# EasyEDA Pro project Automatic-Watering.eprj

# Schematic Schematic1
Board Name: Board1; Create Date: 2024-10-25; Page Name: P1; Project Name: 办公室盆栽自动浇水仪; Schematic Name: Schematic1; Update Date: 2024-12-15; Company: 嘉立创EDA; Page Size: A4; Version: V1.0
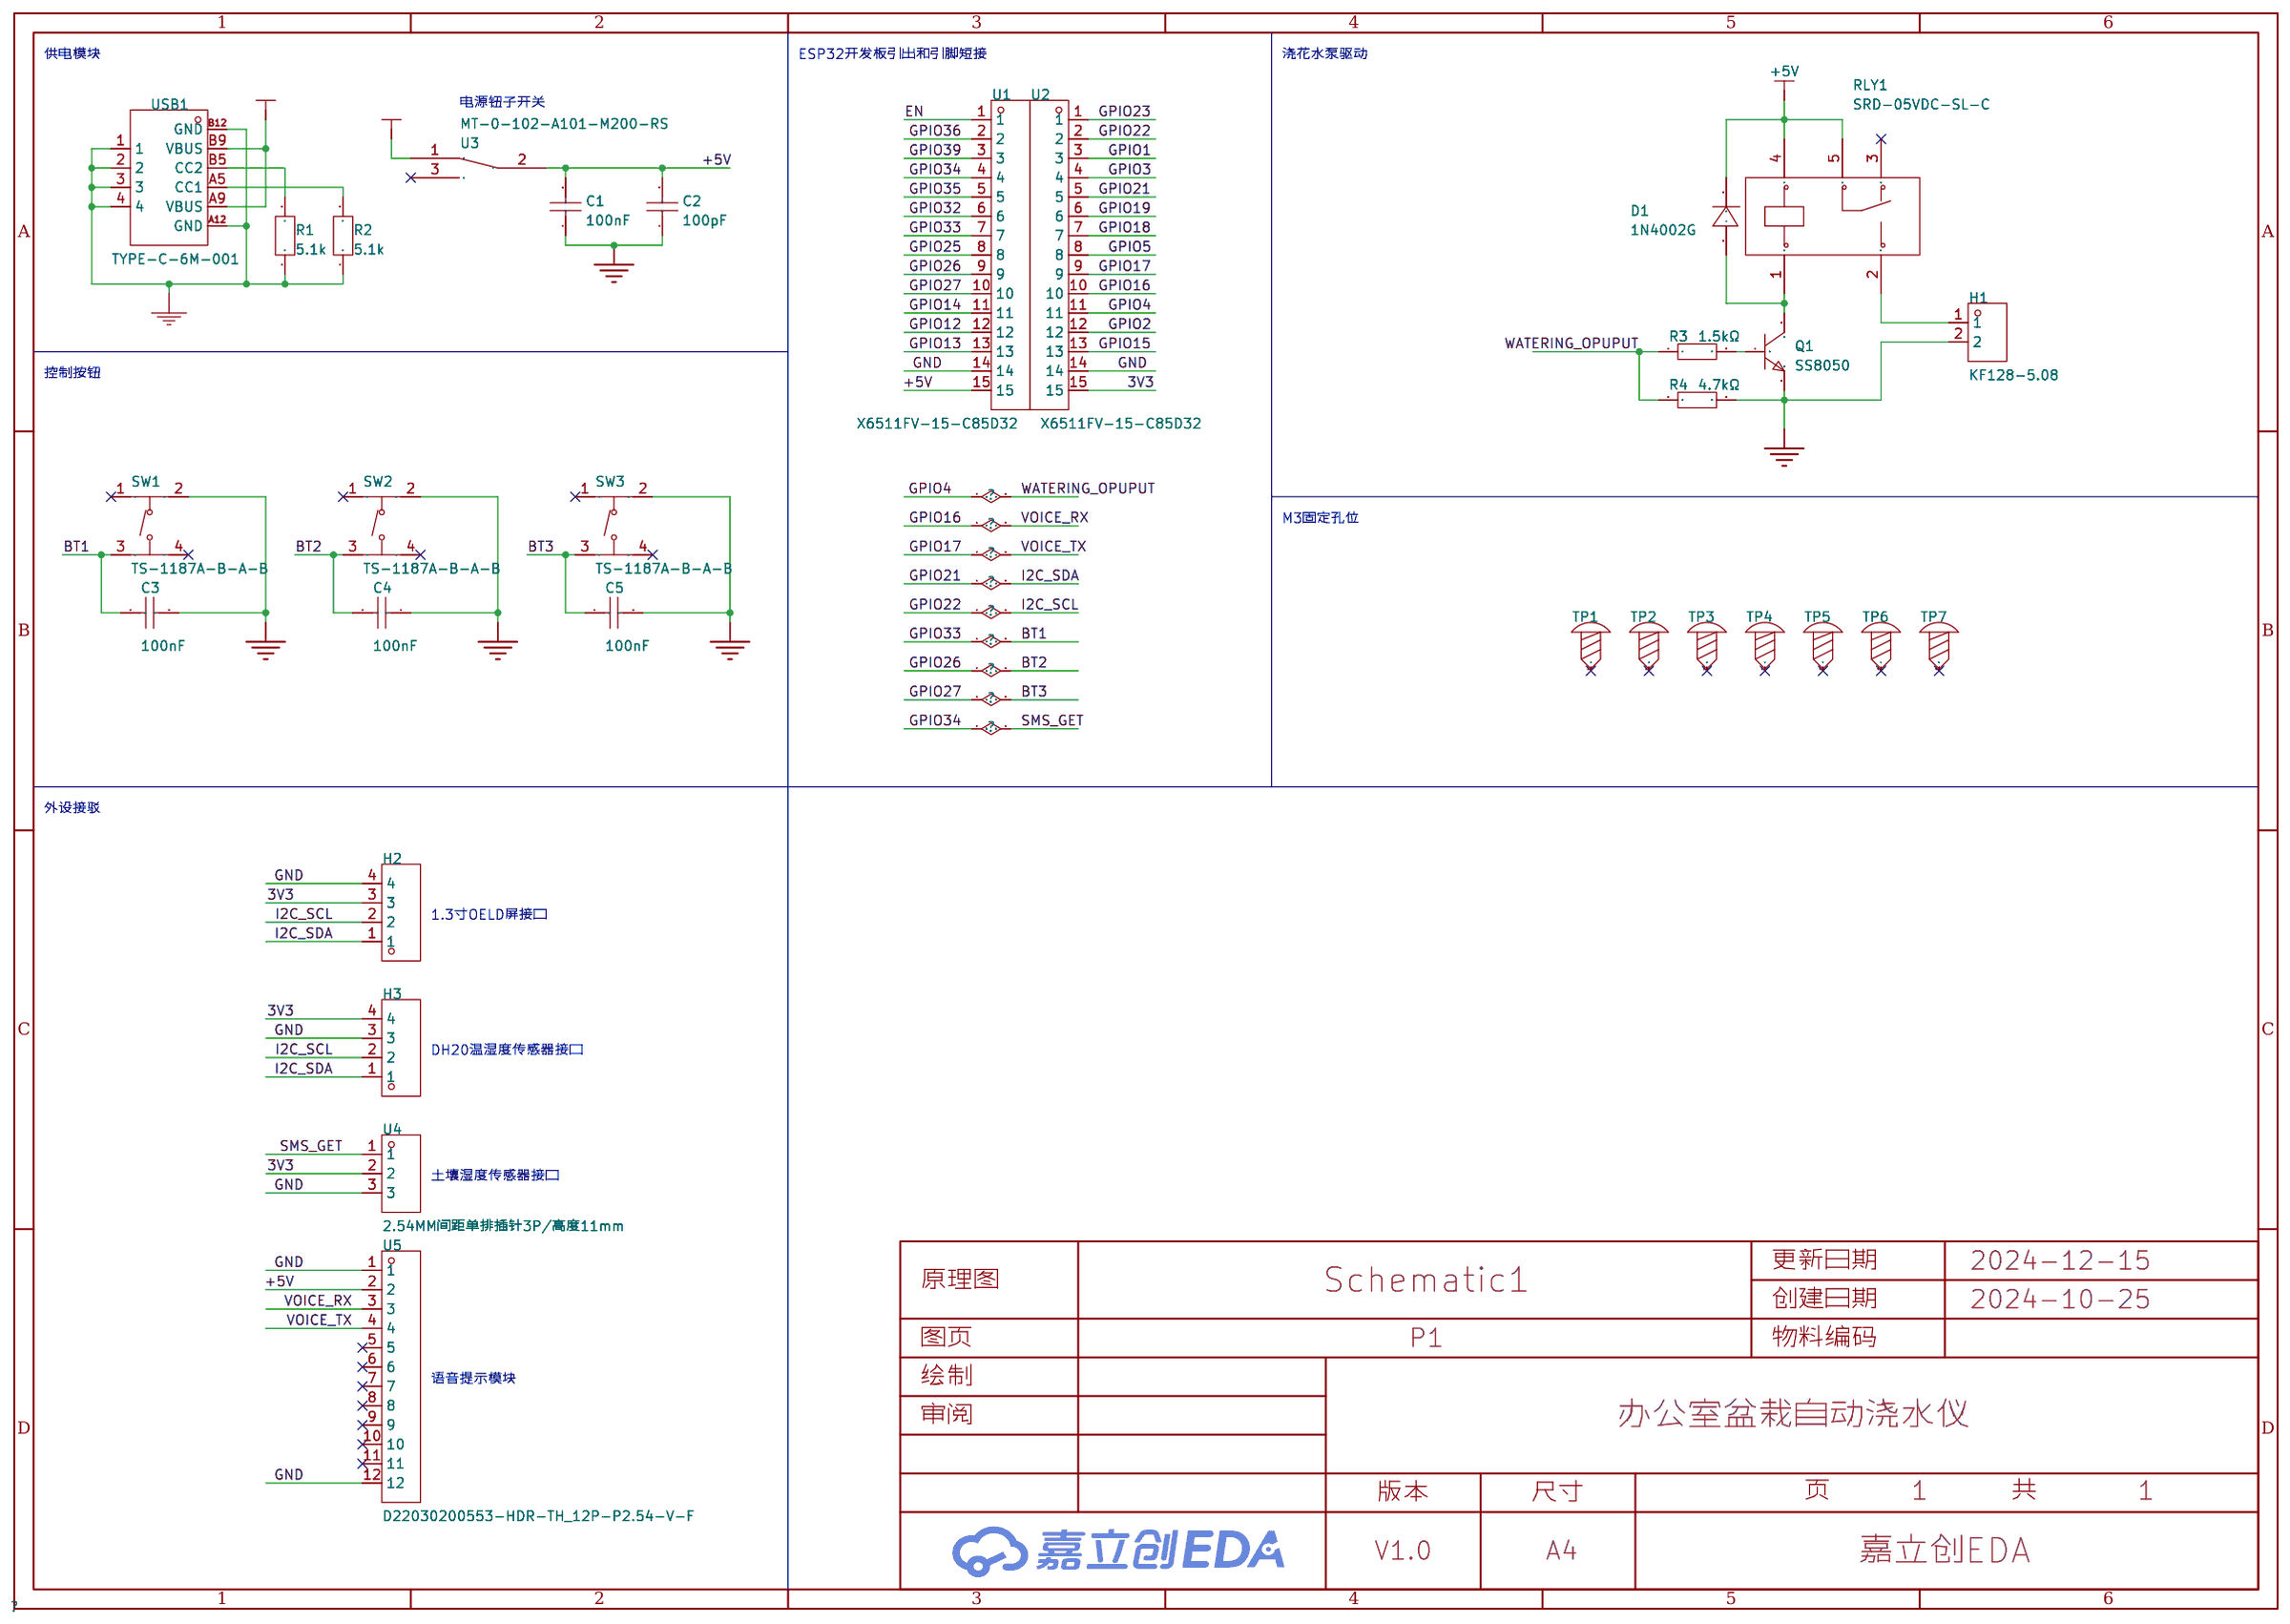
[diagram p0: schematic sheet]

## Parts
C1  100nF  [C0805]
C2  100pF  [C0805]
C3  100nF  [C0805]
C4  100nF  [C0805]
C5  100nF  [C0805]
D1  1N4002G  [SMA_L4.4-W2.6-LS5.0-RD]
H1  KF128-5.08  [CONN-TH_P5.08_KF128-5.08-2P]
H2  -  [hdr-th_4p-p2.54-v-f]
H3  -  [hdr-th_4p-p2.54-v-f]
Q1  SS8050  [SOT-23-3_L2.9-W1.3-P1.90-LS2.4-BR]
R1  5.1k  [R0603]
R2  5.1k  [R0603]
R3  1.5kΩ  [R0805]
R4  4.7kΩ  [R0805]
RLY1  SRD-05VDC-SL-C  [RELAY-TH_SRD-XXVDC-XL-C]
SW1  TS-1187A-B-A-B  [SW-SMD_4P-L5.1-W5.1-P3.70-LS6.5-TL-2]
SW2  TS-1187A-B-A-B  [SW-SMD_4P-L5.1-W5.1-P3.70-LS6.5-TL-2]
SW3  TS-1187A-B-A-B  [SW-SMD_4P-L5.1-W5.1-P3.70-LS6.5-TL-2]
TP1  -  [M3螺丝]
TP2  -  [M3螺丝]
TP3  -  [M3螺丝]
TP4  -  [M3螺丝]
TP5  -  [M3螺丝]
TP6  -  [M3螺丝]
TP7  -  [M3螺丝]
U1  X6511FV-15-C85D32  [HDR-TH_15P-P2.54-V-F]
U2  X6511FV-15-C85D32  [HDR-TH_15P-P2.54-V-F]
U3  MT-0-102-A101-M200-RS  [SW-TH_MT-0-103-A101-M200-RS]
U4  2.54MM间距单排插针3P/高度11mm  [HDR-TH_3P-P2.54-V-M]
U5  D22030200553-HDR-TH_12P-P2.54-V-F  [HDR-TH_12P-P2.54-V-F]
USB1  TYPE-C-6M-001  [USB-C-SMD_918-418K2023S40006]

## Library data of the parts
C1 C3-C5 = CL21B104KCFNNNE: 容值:100nF;精度:±10%;额定电压:100V;材质(温度系数):X7R;; LCSC Part Name: 100nF ±10% 100V; Supplier Part: C28233; Manufacturer: SAMSUNG(三星); Supplier Footprint: 0805; JLCPCB Part Class: 基础库; Datasheet: https://atta.szlcsc.com/upload/public/pdf/source/20160218/1457707763339.pdf; Supplier: LCSC; Tolerance: ±10%; Voltage Rated: 100V; Temperature Coefficient: X7R
C2 = 0805B471K500NT: LCSC Part Name: 470pF ±10% 50V; Supplier Part: C1743; Manufacturer: FH(风华); Supplier Footprint: 0805; JLCPCB Part Class: 基础库; Datasheet: https://atta.szlcsc.com/upload/public/pdf/source/20200305/C486355_26A10D38EF8C2A5C37091D0039909270.pdf; Supplier: LCSC; Tolerance: ±10%; Voltage Rated: 50V; Temperature Coefficient: X7R
D1 = 1N4002G: 二极管配置:独立式;正向压降(Vf):1.1V@1A;直流反向耐压(Vr):100V;平均整流电流(Io):1A;; LCSC Part Name: 电压:100V 电流:1A; Supplier Part: C433393; Manufacturer: SHIKUES(时科); Supplier Footprint: SMA(DO-214AC); JLCPCB Part Class: 扩展库; Datasheet: https://atta.szlcsc.com/upload/public/pdf/source/20190930/C433394_5D552CB45C988F03E40D828D360C69B1.pdf; Supplier: LCSC; Diode Configuration: 独立式; Forward Voltage (Vf@If): 1.1V@1A; Reverse Voltage (Vr): 100V; Average Rectified Current (Io): 1A; Reverse Leakage Current: 5uA@100V
H1 = KF128-5.08-2P-AA: 结构:1x2P;间距:5.08mm;颜色:绿色;安装方式:直插;额定电流:24A;额定电压:250V;排数:1;线规 - AWG:12~22;线规 - 平方毫米:2.5;每排PIN数:2;工作温度范围:-40℃~+105℃;; LCSC Part Name: 5.08mm 1x2P 排数:1 每排P数:2 直插; Supplier Part: C474952; Manufacturer: KEFA(科发); Supplier Footprint: 插件,P=5.08mm; JLCPCB Part Class: 扩展库; Datasheet: https://atta.szlcsc.com/upload/public/pdf/source/20230317/DADFED05827EAD48C1D5B8C3D4CF88F4.pdf; Supplier: LCSC; Structure: 1x2P; Pitch: 5.08mm; Color: 绿色; Mounting Style: 直插; Current Rating (Max): 24A; Voltage Rating (Max): 250V; Number of Pins: 2P; Number of Rows: 1; Wire Gauge - AWG: 12~22; Wire Gauge - mm2: 2.5; Number of PINs Per Row: 2; Operating Temperature Range: -40℃~+105℃
H2 H3 = HDR-F_2.54_1x4P: Supplier Part: C2718488; Supplier Footprint: 插件; JLCPCB Part Class: 扩展库
Q1 = SS8050: LCSC Part Name: NPN 25V 1.5A 120-400 SOT-23; Supplier Part: C2931717; Manufacturer: Doeshare(德芯); Supplier Footprint: SOT-23; Datasheet: https://atta.szlcsc.com/upload/public/pdf/source/20220106/99F9A3DFCBDD91265C711555CE6390BF.pdf; Supplier: LCSC
R1 R2 = 5.1k
R3 = 0805W8F1501T5E: LCSC Part Name: 1.5kΩ ±1% 125mW 厚膜电阻; Supplier Part: C4310; Manufacturer: UNI-ROYAL(厚声); Supplier Footprint: 0805; Datasheet: https://atta.szlcsc.com/upload/public/pdf/source/20200306/C422600_1E6D84923E4A46A82E41ADD87F860B5C.pdf; Supplier: LCSC; Type: 厚膜电阻; Tolerance: ±1%; Power(Watts): 125mW; Overload Voltage (Max): 150V; Temperature Coefficient: ±100ppm/℃; Operating Temperature Range: -55℃~+155℃
R4 = 0805W8F4701T5E: LCSC Part Name: 4.7kΩ ±1% 125mW 厚膜电阻; Supplier Part: C17673; Manufacturer: UNI-ROYAL(厚声); Supplier Footprint: 0805; Datasheet: https://atta.szlcsc.com/upload/public/pdf/source/20200306/C422600_1E6D84923E4A46A82E41ADD87F860B5C.pdf; Supplier: LCSC; Type: 厚膜电阻; Tolerance: ±1%; Power(Watts): 125mW; Overload Voltage (Max): 150V; Temperature Coefficient: ±100ppm/℃; Operating Temperature Range: -55℃~+155℃
RLY1 = SRD-05VDC-SL-C: LCSC Part Name: 蓝色; Supplier Part: C35449; Manufacturer: 松乐; Supplier Footprint: 插件,15.6x19.2mm; JLCPCB Part Class: 扩展库; Datasheet: https://atta.szlcsc.com/upload/public/pdf/source/20200305/C490149_C96E4098A3B1FFB377D5AD2E40B7C2A8.pdf; Supplier: LCSC; Coil Voltage: 5V; Contact Form: 一组转换:1C(单刀双掷-转换); Pin Number: 5; Maximum Switching Voltage: 250V@AC; Coil Rated Power: 360mW; Maximum Switching Current: 15A; Coil Type: 无极性-单线圈; Coil Resistance: 70Ω; Contact Resistance: 100mΩ; Operate Time: 10ms; Release Time: 10ms
SW1-SW3 = TS-1187A-B-A-B: 电路结构:单刀单掷;按钮形状:圆形按钮;作用力:160gf;安装方式:立贴;开关长度:5.1mm;开关宽度:5.1mm;开关高度:1.5mm;带支架:不带;触点电流:50mA;额定电压(DC):12V;绝缘电阻:-;带灯:无;机械寿命:10万次;; LCSC Part Name: 5.1*5.1*1.5mm 立贴 轻触开关; Supplier Part: C318884; Manufacturer: XKB Connectivity(中国星坤); Supplier Footprint: SMD; JLCPCB Part Class: 基础库; Datasheet: https://atta.szlcsc.com/upload/public/pdf/source/20200227/C318890_053E50208A88A7BA1965D8746000774E.pdf; Supplier: LCSC; Circuit: 单刀单掷; Actuator Style: 圆形按钮; Operating Force: 160gf; Mounting Style: 立贴; Switch Length: 5.1mm; Switch Width: 5.1mm; Switch Height: 1.5mm; Strike Gundam: 不带; Contact Current: 50mA; Voltage Rating (DC): 12V; Actuator/Cap Color: 金色; With Lamp: 无; Mechanical Life: 10万次; Operating Temperature: -30℃~+85℃
TP1-TP7 = M3螺丝: Supplier Footprint: 插件
U1 U2 = X6511FV-15-C85D32: LCSC Part Name: 间距:2.54mm 1x15P 直插; Supplier Part: C2883732; Manufacturer: XKB Connectivity(中国星坤); Supplier Footprint: 插件,P=2.54mm; Datasheet: https://atta.szlcsc.com/upload/public/pdf/source/20211009/E31A179D77B4765F9C2936200B697B47.pdf; Supplier: LCSC; Holes Structure: 1x15P; Pitch: 2.54mm; Circular Hole / Square Hole: 方孔; Mounting Type: 直插; Number of Rows: 单排; Number of Holes: 15P; Current Rating (Max): 3A; Voltage Rating (Max): 250V; Holes Direction: 顶部; Insulation Height: 8.5mm; Contact Material: 黄铜; Contact Plating: 金; Operating Temperature Range: -40℃~+105℃; Soldering Temperature(Max): 260℃
U3 = MT-0-102-A101-M200-RS: 电路结构:单刀双掷;机械寿命:-;额定电流:5A;额定电压(AC):125V;安装方式:直插;; LCSC Part Name: 小型钮子三脚二档 五件套; Supplier Part: C1788492; Manufacturer: YUEN FUNG(源丰); Supplier Footprint: 插件; JLCPCB Part Class: 扩展库; Datasheet: https://atta.szlcsc.com/upload/public/pdf/source/20230720/8E5C36EFDF374AE4FF4AC09DB233CE0E.pdf; Supplier: LCSC; Circuit: 单刀双掷; Switch Length: 13mm; Switch Width: 8mm; Switch Height: 28.6mm; Contact Current: 5A; Voltage Rating (AC): 125V; Actuator Type: 圆柱钮柄; Pin Style: 焊片; Mounting Style: 直插; Operating Temperature: -25℃~+85℃
U4 = 2.54MM间距单排插针3P/高度11mm: Supplier Part: C9900010938; JLCPCB Part Class: 扩展库; Supplier: LCSC
U5 = D22030200553-HDR-TH_12P-P2.54-V-F: Supplier Part: C9900009321; Supplier: LCSC
USB1 = TYPE-C-6M-001: Supplier: LCSC; Supplier Part: C2798175; Manufacturer: USAKRO(美韩); JLCPCB Part Class: Extended Part

## Nets
3V3: H2.3 H3.4 U2.15 U4.2
+5V: C1.2 C2.2 D1.1(C) RLY1.4 RLY1.5 U1.15 U3.2 U5.2
GND: C1.1 C2.1 C3.2 C4.2 C5.2 H1.2 H2.4 H3.3 Q1.2(E) R1.1 R2.1 R4.2 SW1.2(B) SW2.2(B) SW3.2(B) U1.14 U2.14 U4.3 U5.1 U5.12 USB1.1 USB1.2 USB1.3 USB1.4 USB1.A12(GND) USB1.B12(GND)
BT1: C3.1 SW1.3(C) U1.7
BT2: C4.1 SW2.3(C) U1.9
BT3: C5.1 SW3.3(C) U1.10
EN: U1.1
GPIO1: U2.3
GPIO2: U2.12
GPIO3: U2.4
GPIO4: R3.1 R4.1 U2.11
GPIO5: U2.8
GPIO12: U1.12
GPIO13: U1.13
GPIO14: U1.11
GPIO15: U2.13
GPIO16: U2.10 U5.3
GPIO17: U2.9 U5.4
GPIO18: U2.7
GPIO19: U2.6
GPIO21: H2.1 H3.1 U2.5
GPIO22: H2.2 H3.2 U2.2
GPIO23: U2.1
GPIO25: U1.8
GPIO32: U1.6
GPIO34: U1.4 U4.1
GPIO35: U1.5
GPIO36: U1.2
GPIO39: U1.3
VMAIN: U3.1 USB1.A9(VBUS) USB1.B9(VBUS)
$1N590: R1.2 USB1.B5(CC2)
$1N591: R2.2 USB1.A5(CC1)
$1N8974: D1.2(A) Q1.3(C) RLY1.1
$1N9177: Q1.1(B) R3.2
$1N17083: H1.1 RLY1.2

Not connected (* = marked no-connect by the designer): RLY1 3*; SW1 1(A)* 4(D)*; SW2 1(A)* 4(D)*; SW3 1(A)* 4(D)*; TP1 1*; TP2 1*; TP3 1*; TP4 1*; TP5 1*; TP6 1*; TP7 1*; U3 3*; U5 5* 6* 7* 8* 9* 10* 11*

## Notes on the sheet
- 供电模块
- ESP32开发板引出和引脚短接
- 浇花水泵驱动
- 电源钮子开关
- 控制按钮
- M3固定孔位
- 外设接驳
- 1.3寸OELD屏接口
- DH20温湿度传感器接口
- 土壤湿度传感器接口
- 语音提示模块

# Board PCB1
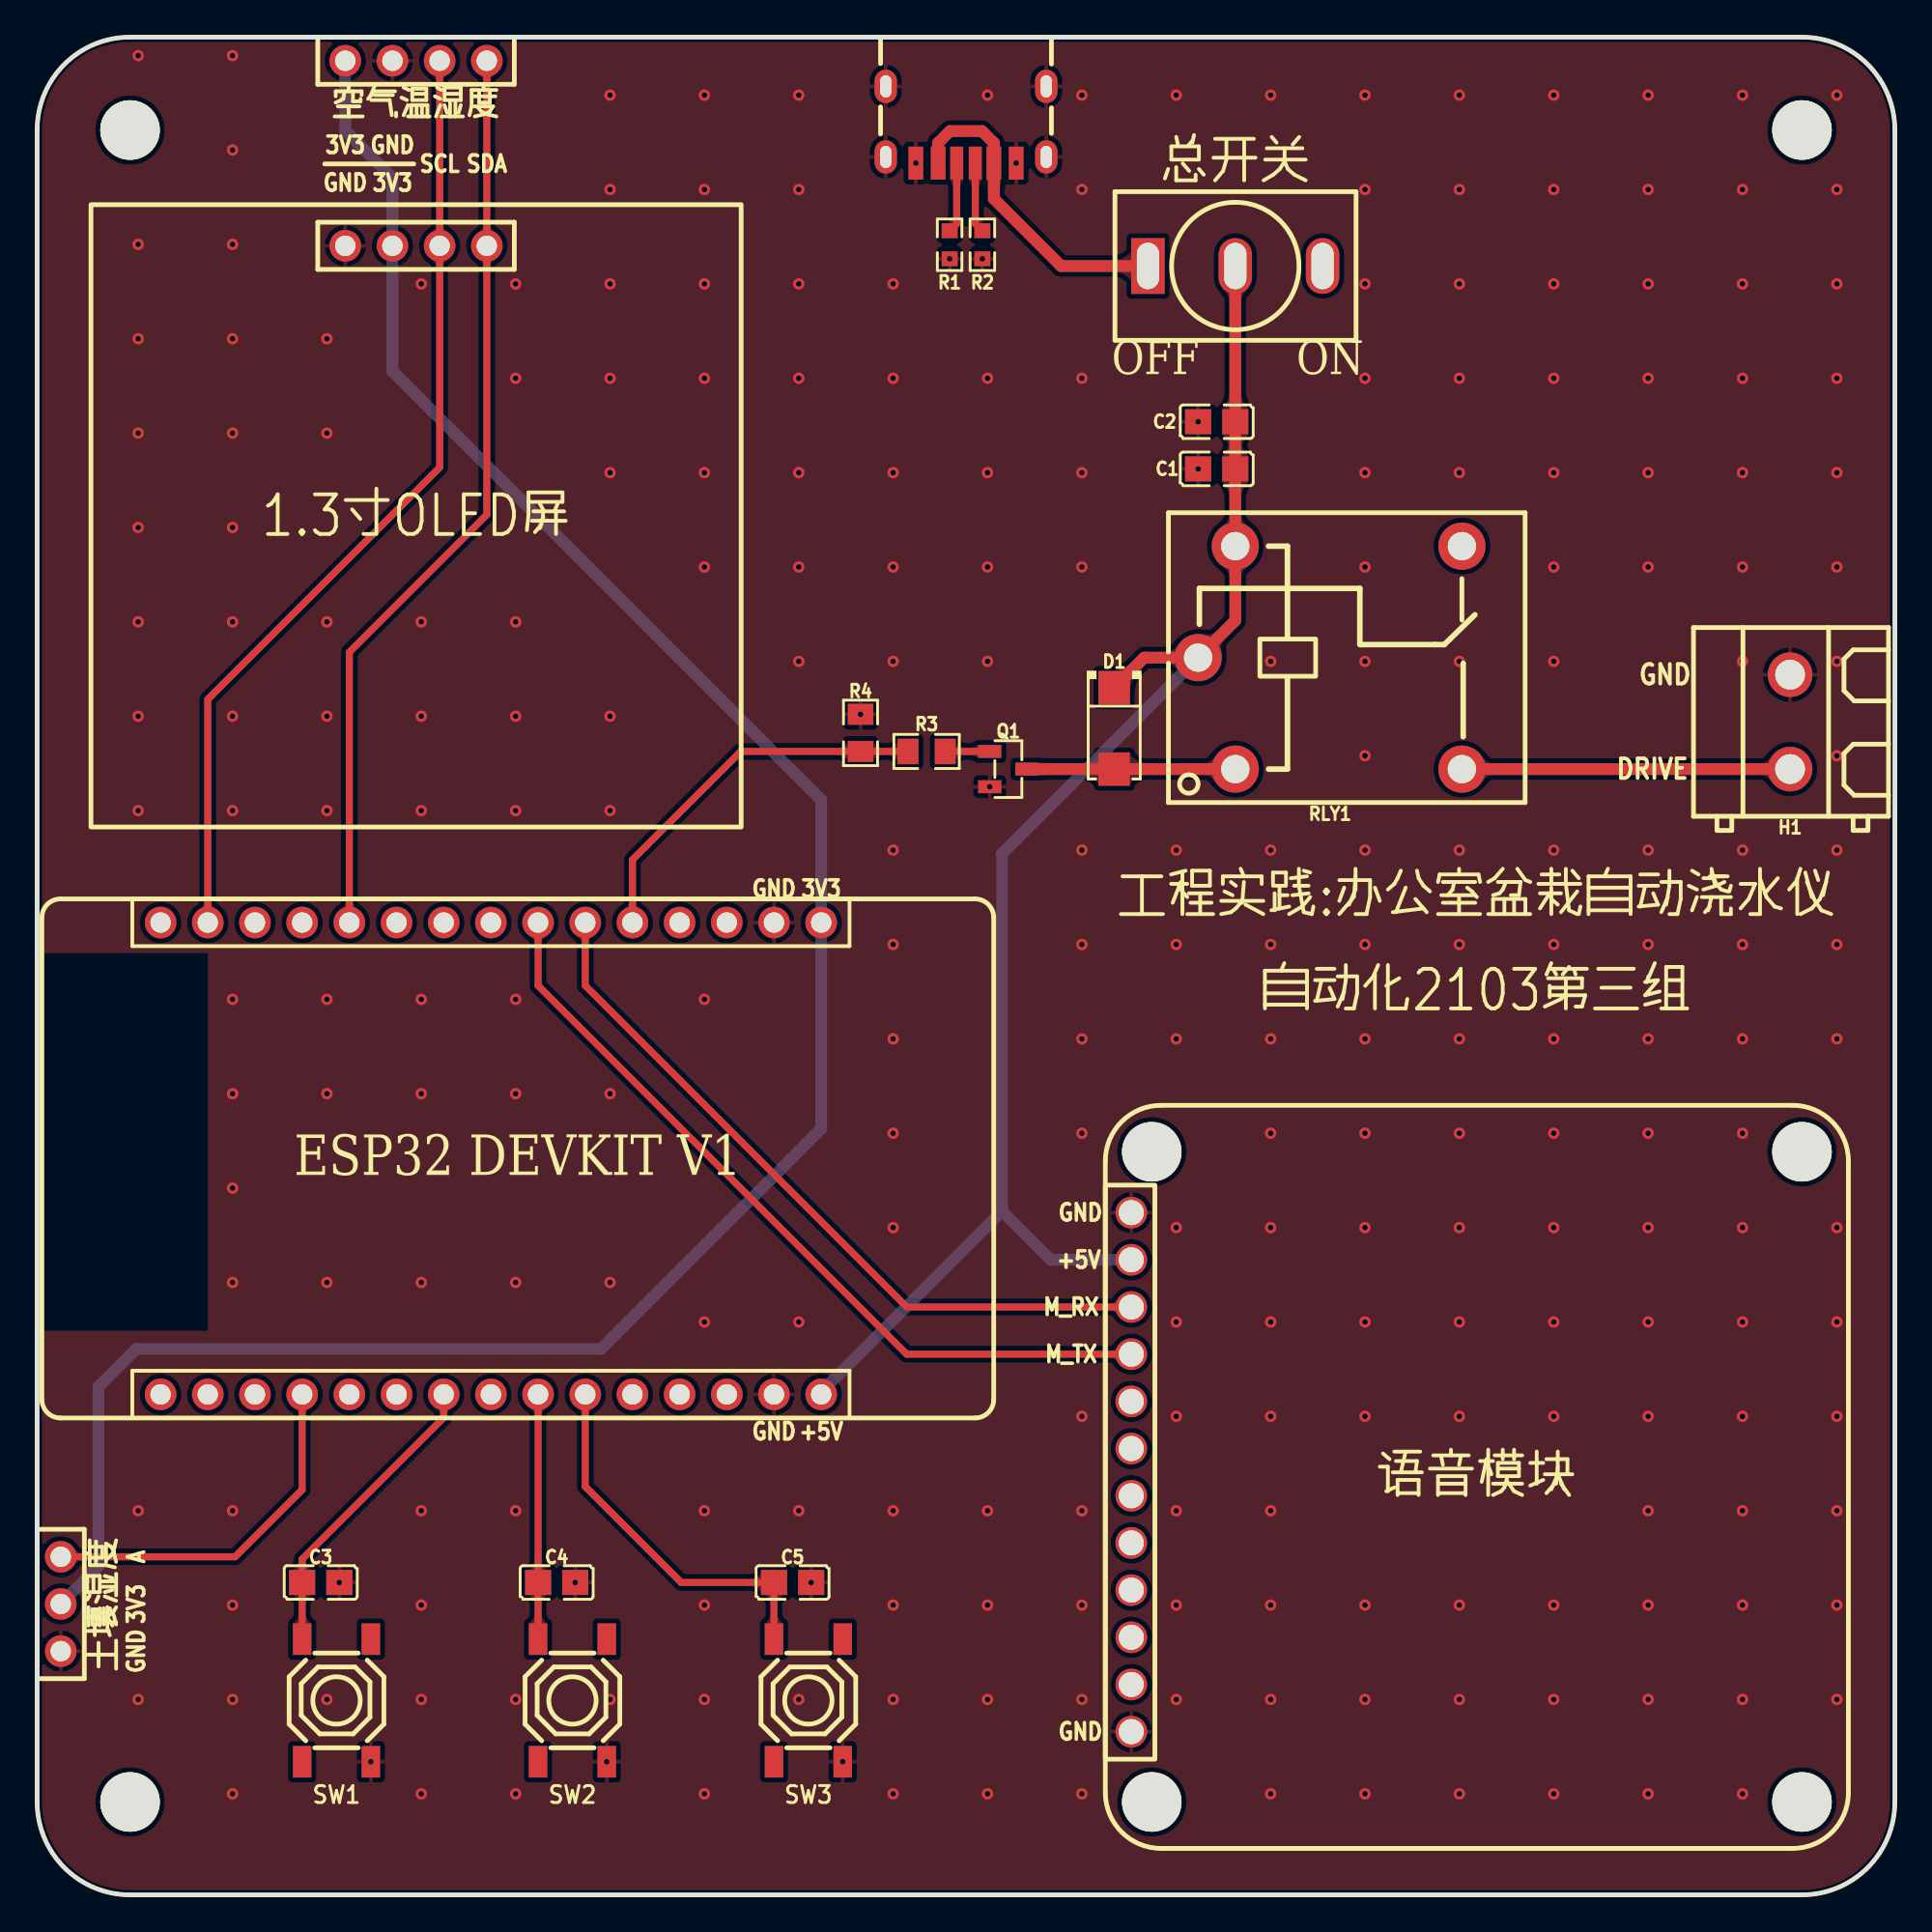
[diagram p1: board, top side]
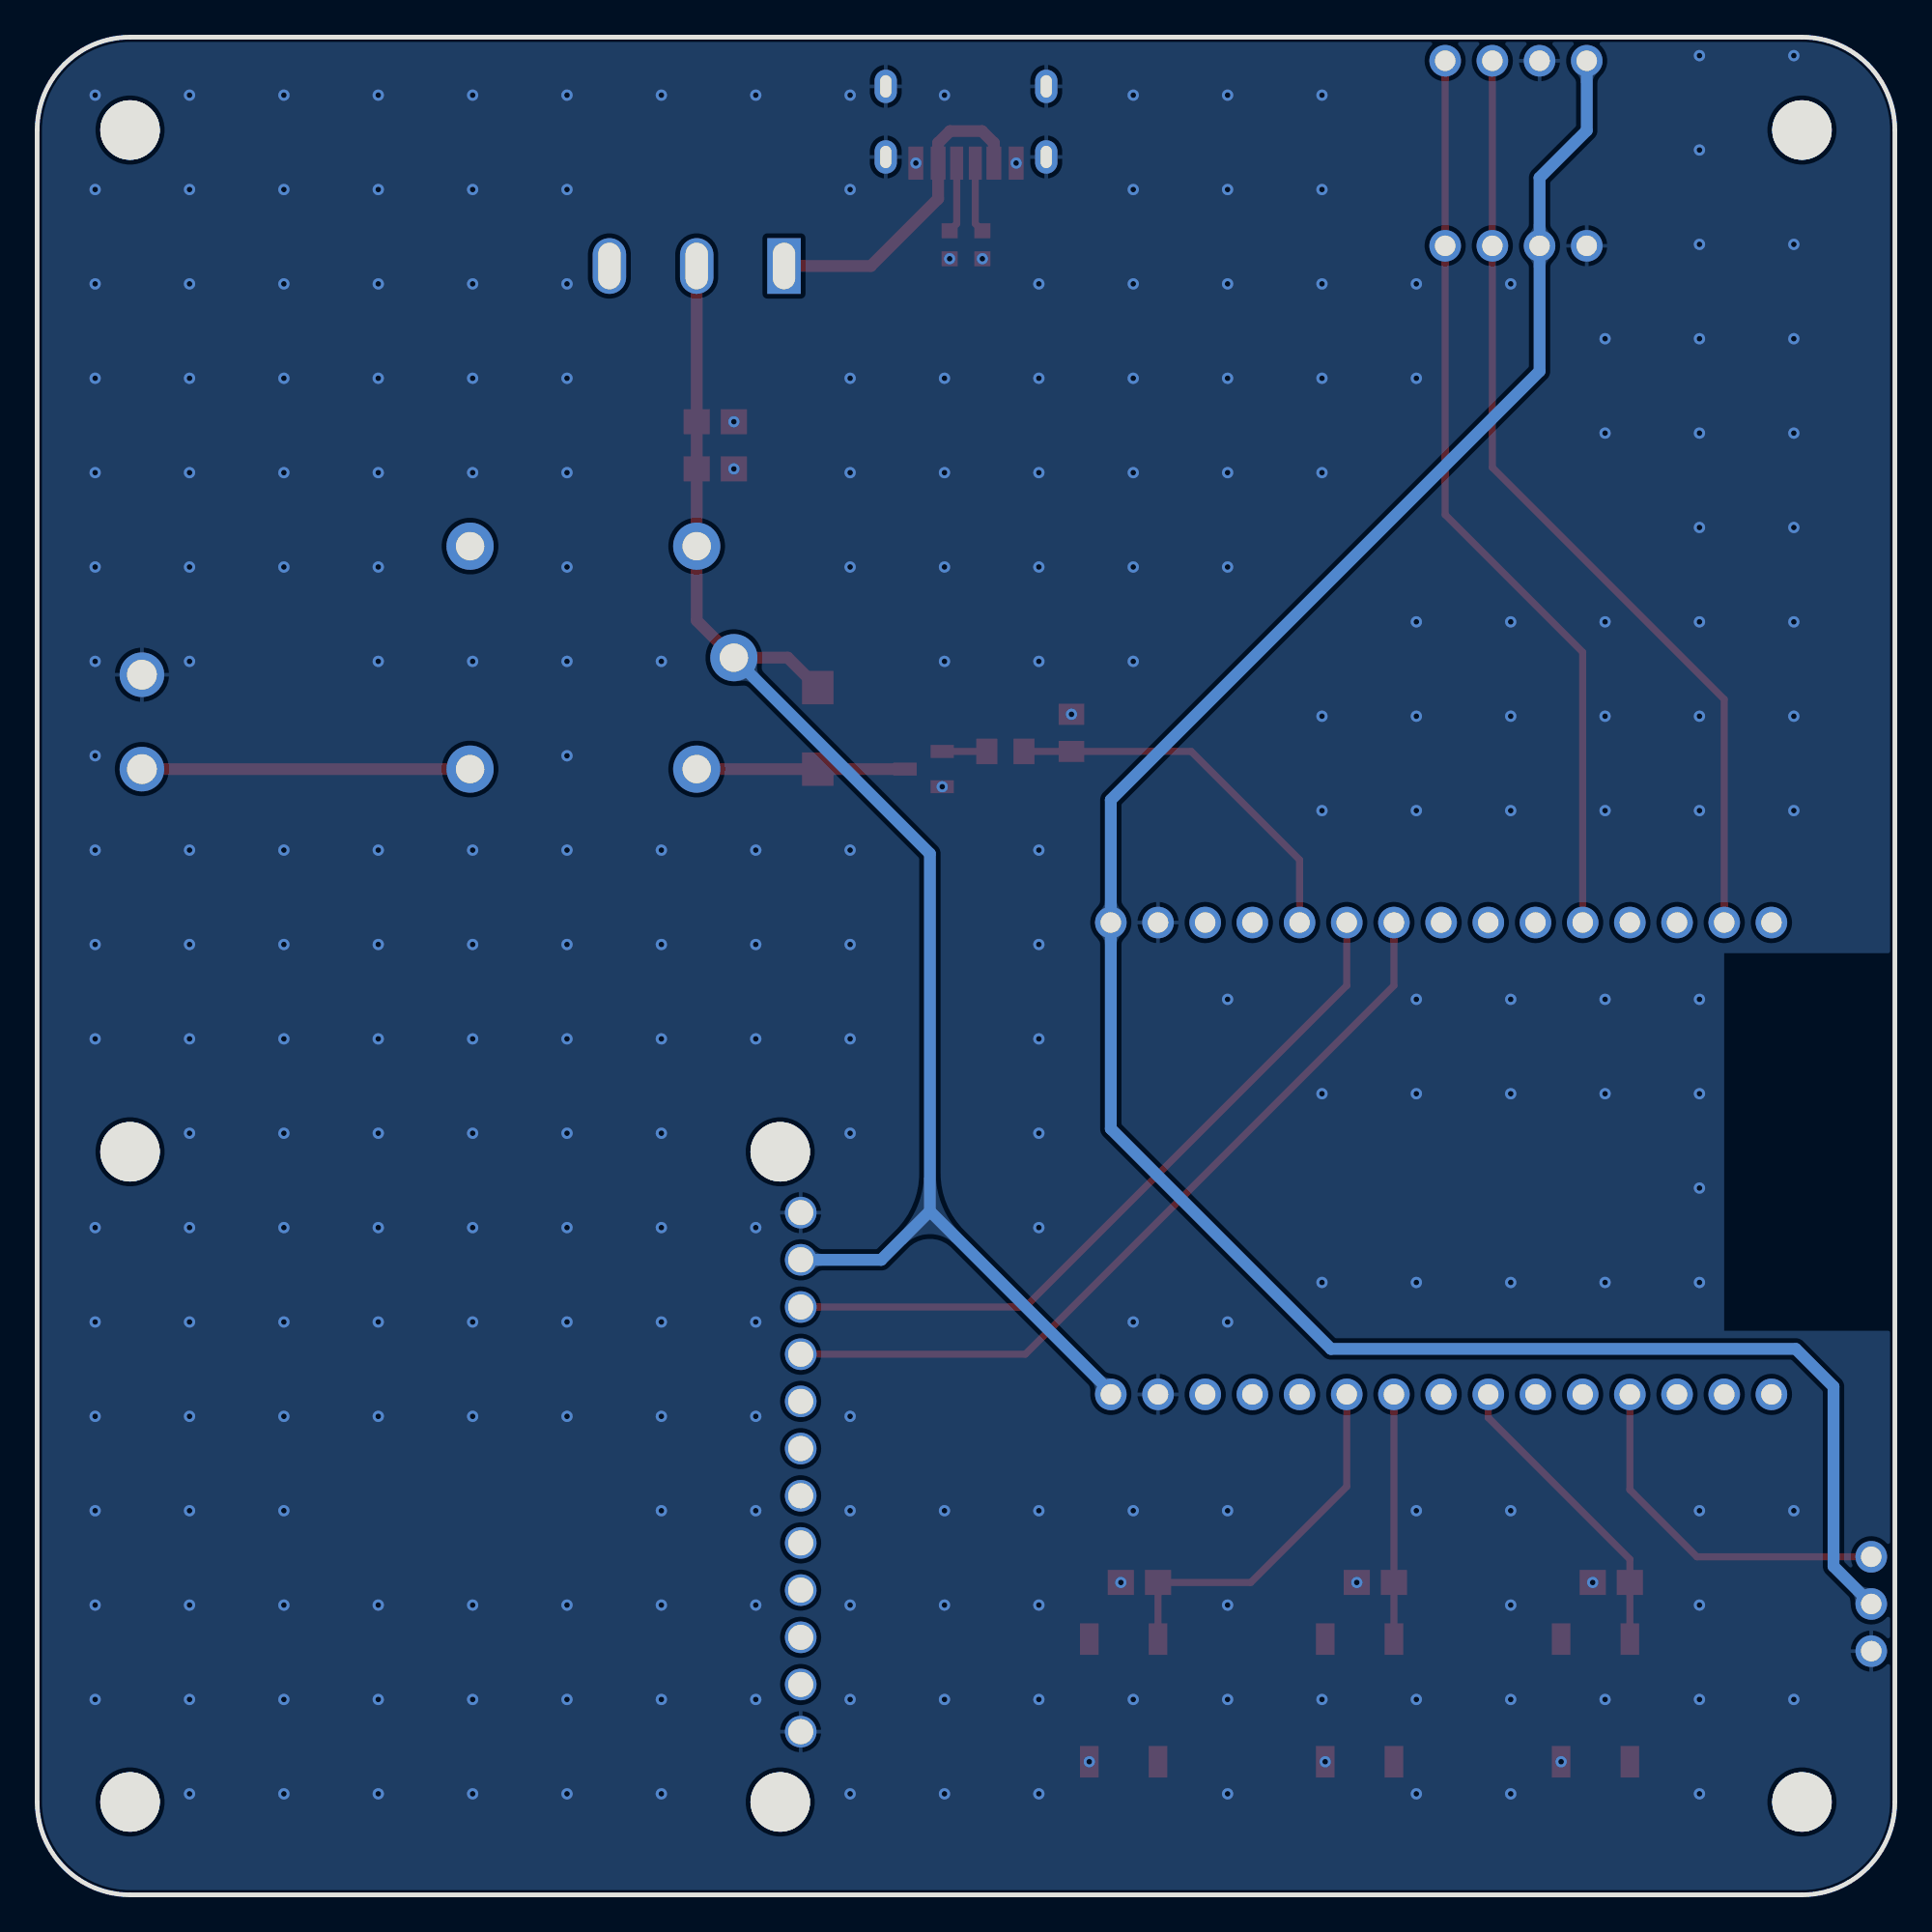
[diagram p2: board, bottom side, seen from below]

Outline 100 x 100 mm; copper layers: Top Layer, Bottom Layer. Coordinates in mm from the lower left corner of the outline.
Outline path: 0,95 0,5 arc(1.46,1.46) 5,0 95,0 arc(98.54,1.46) 100,5 100,95 arc(98.54,98.54) 95,100 5,100 arc(1.46,98.54) 0,95
Stack: Top Layer 0.035mm / Dielectric1 1.51mm FR4 er 4.5 / Bottom Layer 0.035mm

## Design rules (mm)
template: 自定义配置
spacing copperThickness1oz (default): track to track 0.102, other pairs 0.152 to 0.3
spacing copperThickness2oz: track to track 0.203, other pairs 0.152 to 0.3
track width copperThickness1oz (default): min 0.127, default 0.254, max 2.54
track width copperThickness2oz: min 0.203, default 0.254, max 2.54
differential pair differentialPair (default): width min 0.127, default 0.254, max 2.54; gap min 0.152, default 0.152
via viaSize (default): diameter min 0.5, default 0.61, max 10; hole min 0.3, default 0.305, max 6.299

## Placement (name value [footprint] x y rotation side)
C1  100nF  [C0805]  63.5 76.76 0 top
C2  100pF  [C0805]  63.5 79.3 0 top
C3  100nF  [C0805]  15.26 16.81 0 top
C4  100nF  [C0805]  27.96 16.81 0 top
C5  100nF  [C0805]  40.66 16.81 0 top
D1  1N4002G  [SMA_L4.4-W2.6-LS5.0-RD]  57.98 62.79 270 top
H1  KF128-5.08  [CONN-TH_P5.08_KF128-5.08-2P]  94.36 63.14 90 top
H2  -  [hdr-th_4p-p2.54-v-f]  20.4 88.77 180 top
H3  -  [hdr-th_4p-p2.54-v-f]  20.4 98.73 180 top
Q1  SS8050  [SOT-23-3_L2.9-W1.3-P1.90-LS2.4-BR]  52.28 60.6 180 top
R1  5.1k  [R0603]  49.12 88.82 90 top
R2  5.1k  [R0603]  50.88 88.82 90 top
R3  1.5kΩ  [R0805]  47.88 61.55 0 top
R4  4.7kΩ  [R0805]  44.32 62.55 90 top
RLY1  SRD-05VDC-SL-C  [RELAY-TH_SRD-XXVDC-XL-C]  69.6 66.6 0 top
SW1  TS-1187A-B-A-B  [SW-SMD_4P-L5.1-W5.1-P3.70-LS6.5-TL-2]  16.11 10.47 270 top
SW2  TS-1187A-B-A-B  [SW-SMD_4P-L5.1-W5.1-P3.70-LS6.5-TL-2]  28.81 10.47 270 top
SW3  TS-1187A-B-A-B  [SW-SMD_4P-L5.1-W5.1-P3.70-LS6.5-TL-2]  41.51 10.47 270 top
TP1  -  [M3螺丝]  5.06 94.94 0 top
TP2  -  [M3螺丝]  5.06 4.94 0 top
TP3  -  [M3螺丝]  95.06 4.94 0 top
TP4  -  [M3螺丝]  95.06 94.94 0 top
TP5  -  [M3螺丝]  95.06 39.94 0 top
TP6  -  [M3螺丝]  60.06 39.94 0 top
TP7  -  [M3螺丝]  60.06 4.94 0 top
U1  X6511FV-15-C85D32  [HDR-TH_15P-P2.54-V-F]  24.42 26.94 0 top
U2  X6511FV-15-C85D32  [HDR-TH_15P-P2.54-V-F]  24.42 52.34 0 top
U3  MT-0-102-A101-M200-RS  [SW-TH_MT-0-103-A101-M200-RS]  64.5 87.68 0 top
U4  2.54MM间距单排插针3P/高度11mm  [HDR-TH_3P-P2.54-V-M]  1.27 15.66 270 top
U5  D22030200553-HDR-TH_12P-P2.54-V-F  [HDR-TH_12P-P2.54-V-F]  58.9 22.75 270 top
USB1  TYPE-C-6M-001  [USB-C-SMD_918-418K2023S40006]  50 95.45 180 top

## Footprints (pads in the part's own frame, mm; a bottom-side part is the same pattern mirrored in y, then rotated)
C0805
  rect 1.41x1.35 smd: 1(-1,0) 2(1,0)
CONN-TH_P5.08_KF128-5.08-2P
  round 2.4 hole 1.6x1.42: 1(-2.54,0) 2(2.54,0)
HDR-TH_3P-P2.54-V-M
  round 1.7 hole 1.1x0.89: 1(-2.54,0) 2(0,0) 3(2.54,0)
hdr-th_4p-p2.54-v-f
  round 1.7 hole 1.1x0.89: 1(-3.81,0) 2(-1.27,0) 3(1.27,0) 4(3.81,0)
HDR-TH_12P-P2.54-V-F
  round 1.7 hole 1.35: 1(-13.97,0) 2(-11.43,0) 3(-8.89,0) 4(-6.35,0) 5(-3.81,0) 6(-1.27,0) 7(1.27,0) 8(3.81,0) 9(6.35,0) 10(8.89,0) 11(11.43,0) 12(13.97,0)
HDR-TH_15P-P2.54-V-F
  round 1.7 hole 1.1x0.89: 1(-17.78,0) 2(-15.24,0) 3(-12.7,0) 4(-10.16,0) 5(-7.62,0) 6(-5.08,0) 7(-2.54,0) 8(0,0) 9(2.54,0) 10(5.08,0) 11(7.62,0) 12(10.16,0) 13(12.7,0) 14(15.24,0) 15(17.78,0)
M3螺丝
  round 3.2 hole 3.2: 1(-0.064,0.064)
R0603
  rect 0.806x0.864 smd: 1(-0.753,0) 2(0.753,0)
R0805
  rect 1.133x1.377 smd: 1(-1,0) 2(1,0)
RELAY-TH_SRD-XXVDC-XL-C
  round 2.54 hole 1.524x1.27: 1(-5.1,-6) 2(7.1,-6) 3(7.1,6) 4(-5.1,6) 5(-7.1,0)
SMA_L4.4-W2.6-LS5.0-RD
  rect 1.8x1.7 smd: 1(-2.192,0) 2(2.192,0)
SOT-23-3_L2.9-W1.3-P1.90-LS2.4-BR
  rect 1.25x0.7 smd: 1(1,-0.95) 2(1,0.95) 3(-1,0)
SW-SMD_4P-L5.1-W5.1-P3.70-LS6.5-TL-2
  rect 1.7x1 smd: 1(-3.3,1.85) 2(3.3,1.85) 3(-3.3,-1.85) 4(3.3,-1.85)
SW-TH_MT-0-103-A101-M200-RS
  rect 1.8x3 hole 1.2x2.5: 1(-4.7,0)
  oval 1.8x3 hole 1.2x2.5: 2(0,0) 3(4.7,0)
USB-C-SMD_918-418K2023S40006
  oval 1.2x1.8 hole 0.6x1.2: 1(4.32,1.9) 2(4.32,-1.9) 3(-4.32,-1.9) 4(-4.32,1.9)
  rect 0.7x1.778 smd: A5(-0.5,2.231) B5(0.5,2.231)
  rect 0.8x1.778 smd: A9(1.5,2.231) A12(2.7,2.231) B9(-1.5,2.231) B12(-2.7,2.231)

## Nets
As in the schematic.

Pads without a net: RLY1 3; SW1 1 4; SW2 1 4; SW3 1 4; TP1 1; TP2 1; TP3 1; TP4 1; TP5 1; TP6 1; TP7 1; U3 3; U5 5 6 7 8 9 10 11

## Via types
v1: diameter 0.61, hole 0.305, Top Layer to Bottom Layer, 267 vias

## Routing (per net, layer and track width the routed paths; a pad name or vN(x,y) marks a point on that pad's centre or on a via; arc(x,y) is an arc through that point)
3V3: length 125.3
  Bottom Layer w0.635: H3.4 16.59,94.97 19.13,92.43 H2.3 19.13,82.02 42.2,58.94 U2.15 42.2,41.24 30.35,29.39 5.33,29.39 3.3,27.36 3.3,17.69 U4.2
+5V: length 83.3
  Top Layer w0.635: D1.1 59.59,66.6 RLY1.5 64.5,68.6 RLY1.4 C1.2 C2.2 U3.2
  Bottom Layer w0.635: RLY1.5 51.94,56.05 51.94,36.81 ; 42.08,26.94 51.94,36.81 ; 51.94,36.81 54.56,34.18 U5.2
GND:
  vias: v1(5.44,99.01) v1(5.44,88.85) v1(5.44,83.77) v1(5.44,78.69) v1(5.44,73.61) v1(5.44,68.53) v1(5.44,63.45) v1(5.44,58.37) v1(5.44,20.68) v1(5.44,10.52) v1(10.52,99.01) v1(10.52,93.93) v1(10.52,88.85) v1(10.52,83.77) v1(10.52,78.69) v1(10.52,73.61) v1(10.52,68.53) v1(10.52,63.45) v1(10.52,58.37) v1(10.52,48.21) v1(10.52,43.13) v1(10.52,38.05) v1(10.52,32.97) v1(10.52,20.68) v1(10.52,15.6) v1(10.52,10.52) v1(10.52,5.44) v1(15.6,83.77) v1(15.6,78.69) v1(15.6,68.53) v1(15.6,63.45) v1(15.6,58.37) v1(15.6,48.21) v1(15.6,43.13) v1(15.6,32.97) v1(15.6,10.52) v1(16.26,16.81) v1(17.96,7.16) v1(20.68,86.72) v1(20.68,68.53) v1(20.68,63.45) v1(20.68,58.37) v1(20.68,48.21) v1(20.68,43.13) v1(20.68,32.97) v1(20.68,20.68) v1(20.68,15.6) v1(20.68,10.52) v1(20.68,5.44) v1(25.76,86.72) v1(25.76,81.64) v1(25.76,68.53) v1(25.76,63.45) v1(25.76,58.37) v1(25.76,48.21) v1(25.76,43.13) v1(25.76,32.97) v1(25.76,20.68) v1(25.76,10.52) v1(25.76,5.44) v1(28.96,16.81) v1(30.66,7.16) v1(30.84,96.88) v1(30.84,91.8) v1(30.84,86.72) v1(30.84,81.64) v1(30.84,76.56) v1(30.84,63.45) v1(30.84,58.37) v1(30.84,43.13) v1(30.84,32.97) v1(30.84,10.52) v1(35.92,96.88) v1(35.92,91.8) v1(35.92,86.72) v1(35.92,81.64) v1(35.92,76.56) v1(35.92,71.48) v1(35.92,48.21) v1(35.92,30.84) v1(35.92,20.68) v1(35.92,15.6) v1(35.92,10.52) v1(35.92,5.44) v1(41,96.88) v1(41,91.8) v1(41,86.72) v1(41,81.64) v1(41,76.56) v1(41,71.48) v1(41,66.4) v1(41,30.84) v1(41,20.68) v1(41,10.52) v1(41.66,16.81) v1(43.36,7.16) v1(44.32,63.55) v1(46.08,86.72) v1(46.08,81.64) v1(46.08,76.56) v1(46.08,71.48) v1(46.08,66.4) v1(46.08,56.24) v1(46.08,51.16) v1(46.08,46.08) v1(46.08,41) v1(46.08,35.92) v1(46.08,20.68) v1(46.08,15.6) v1(46.08,10.52) v1(46.08,5.44) v1(47.3,93.22) v1(49.12,88.07) v1(50.88,88.07) v1(51.16,96.88) v1(51.16,81.64) v1(51.16,76.56) v1(51.16,71.48) v1(51.16,66.4) v1(51.16,20.68) v1(51.16,15.6) v1(51.16,10.52) v1(51.16,5.44) v1(51.28,59.65) v1(52.7,93.22) v1(56.24,96.88) v1(56.24,91.8) v1(56.24,81.64) v1(56.24,76.56) v1(56.24,71.48) v1(56.24,56.24) v1(56.24,51.16) v1(56.24,46.08) v1(56.24,41) v1(56.24,25.76) v1(56.24,20.68) v1(56.24,15.6) v1(56.24,10.52) v1(56.24,5.44) v1(61.32,96.88) v1(61.32,56.24) v1(61.32,51.16) v1(61.32,46.08) v1(61.32,35.92) v1(61.32,30.84) v1(61.32,25.76) v1(61.32,20.68) v1(61.32,15.6) v1(61.32,10.52) v1(62.5,79.3) v1(62.5,76.76) v1(66.4,96.88) v1(66.4,66.4) v1(66.4,56.24) v1(66.4,51.16) v1(66.4,46.08) v1(66.4,41) v1(66.4,35.92) v1(66.4,30.84) v1(66.4,25.76) v1(66.4,20.68) v1(66.4,15.6) v1(66.4,10.52) v1(66.4,5.44) v1(71.48,96.88) v1(71.48,91.8) v1(71.48,86.72) v1(71.48,81.64) v1(71.48,76.56) v1(71.48,71.48) v1(71.48,66.4) v1(71.48,61.32) v1(71.48,56.24) v1(71.48,51.16) v1(71.48,46.08) v1(71.48,41) v1(71.48,35.92) v1(71.48,30.84) v1(71.48,25.76) v1(71.48,15.6) v1(71.48,10.52) v1(71.48,5.44) v1(76.56,96.88) v1(76.56,91.8) v1(76.56,86.72) v1(76.56,81.64) v1(76.56,76.56) v1(76.56,66.4) v1(76.56,56.24) v1(76.56,51.16) v1(76.56,46.08) v1(76.56,41) v1(76.56,35.92) v1(76.56,30.84) v1(76.56,25.76) v1(76.56,15.6) v1(76.56,10.52) v1(76.56,5.44) v1(81.64,96.88) v1(81.64,91.8) v1(81.64,86.72) v1(81.64,81.64) v1(81.64,76.56) v1(81.64,71.48) v1(81.64,66.4) v1(81.64,56.24) v1(81.64,51.16) v1(81.64,46.08) v1(81.64,41) v1(81.64,35.92) v1(81.64,30.84) v1(81.64,25.76) v1(81.64,15.6) v1(81.64,10.52) v1(81.64,5.44) v1(86.72,96.88) v1(86.72,91.8) v1(86.72,86.72) v1(86.72,81.64) v1(86.72,76.56) v1(86.72,71.48) v1(86.72,56.24) v1(86.72,51.16) v1(86.72,46.08) v1(86.72,41) v1(86.72,35.92) v1(86.72,30.84) v1(86.72,25.76) v1(86.72,20.68) v1(86.72,15.6) v1(86.72,10.52) v1(86.72,5.44) v1(91.8,96.88) v1(91.8,91.8) v1(91.8,86.72) v1(91.8,81.64) v1(91.8,76.56) v1(91.8,71.48) v1(91.8,66.4) v1(91.8,56.24) v1(91.8,51.16) v1(91.8,46.08) v1(91.8,41) v1(91.8,35.92) v1(91.8,30.84) v1(91.8,25.76) v1(91.8,20.68) v1(91.8,15.6) v1(91.8,10.52) v1(91.8,5.44) v1(96.88,96.88) v1(96.88,91.8) v1(96.88,86.72) v1(96.88,81.64) v1(96.88,76.56) v1(96.88,71.48) v1(96.88,66.4) v1(96.88,61.32) v1(96.88,56.24) v1(96.88,51.16) v1(96.88,46.08) v1(96.88,35.92) v1(96.88,30.84) v1(96.88,25.76) v1(96.88,20.68) v1(96.88,15.6) v1(96.88,10.52)
BT1: length 16.3
  Top Layer w0.381: U1.7 21.88,25.69 14.26,18.07 C3.1 SW1.3
BT2: length 13.2
  Top Layer w0.381: 26.96,13.76 C4.1 U1.9
BT3: length 20.3
  Top Layer w0.381: 39.66,13.76 39.66,16.81 ; U1.10 29.5,21.98 34.67,16.81 C5.1
GPIO4: length 20.6
  Top Layer w0.381: R3.1 R4.1 37.88,61.55 32.04,55.72 U2.11
GPIO16: length 40
  Top Layer w0.381: U2.10 29.5,48.95 46.81,31.64 U5.3
GPIO17: length 43.5
  Top Layer w0.381: U5.4 46.81,29.1 26.96,48.95 U2.9
GPIO21: length 49.5
  Top Layer w0.381: U2.5 16.8,66.89 24.21,74.3 H2.1 H3.1
GPIO22: length 51.6
  Top Layer w0.381: U2.2 9.18,64.35 21.67,76.83 H2.2 H3.2
GPIO34: length 19.6
  Top Layer w0.381: U1.4 14.26,21.81 10.65,18.2 U4.1
VMAIN: length 17.4
  Top Layer w0.635: U3.1 55.12,87.68 51.5,91.3 USB1.B9 51.5,94.31 50.87,94.94 49.13,94.94 48.5,94.31 USB1.A9
$1N590: length 3.8
  Top Layer w0.381: R1.2 49.5,89.96 USB1.B5
$1N591: length 3.8
  Top Layer w0.381: USB1.A5 50.5,89.96 R2.2
$1N8974: length 11.2
  Top Layer w0.635: Q1.3 D1.2 RLY1.1
$1N9177: length 2.4
  Top Layer w0.381: R3.2 Q1.1
$1N17083: length 17.7
  Top Layer w0.635: RLY1.2 H1.1

## Copper pours and planes (outline as drawn; the poured copper is in the pictures)
GND on Top Layer: 0,100 99.95,100 99.95,0.05 0,0.05
GND on Bottom Layer: 0,100 99.95,100 99.95,0.05 0,0.05

Small or netless copper shapes (teardrops, artwork), in the pictures only: 57 on Top Layer, 10 on Bottom Layer

## Text on the board
Top Silkscreen Layer: GND | 3V3 | +5V | A | SCL | SDA | M_RX | M_TX | DRIVE | 空气温湿度 | 土壤湿度 | OFF | ON | 1.3寸OLED屏 | ESP32 DEVKIT V1 | 总开关 | 工程实践:办公室盆栽自动浇水仪 | 自动化2103第三组 | 语音模块
